# Altium project PERSEUS.PrjPcb
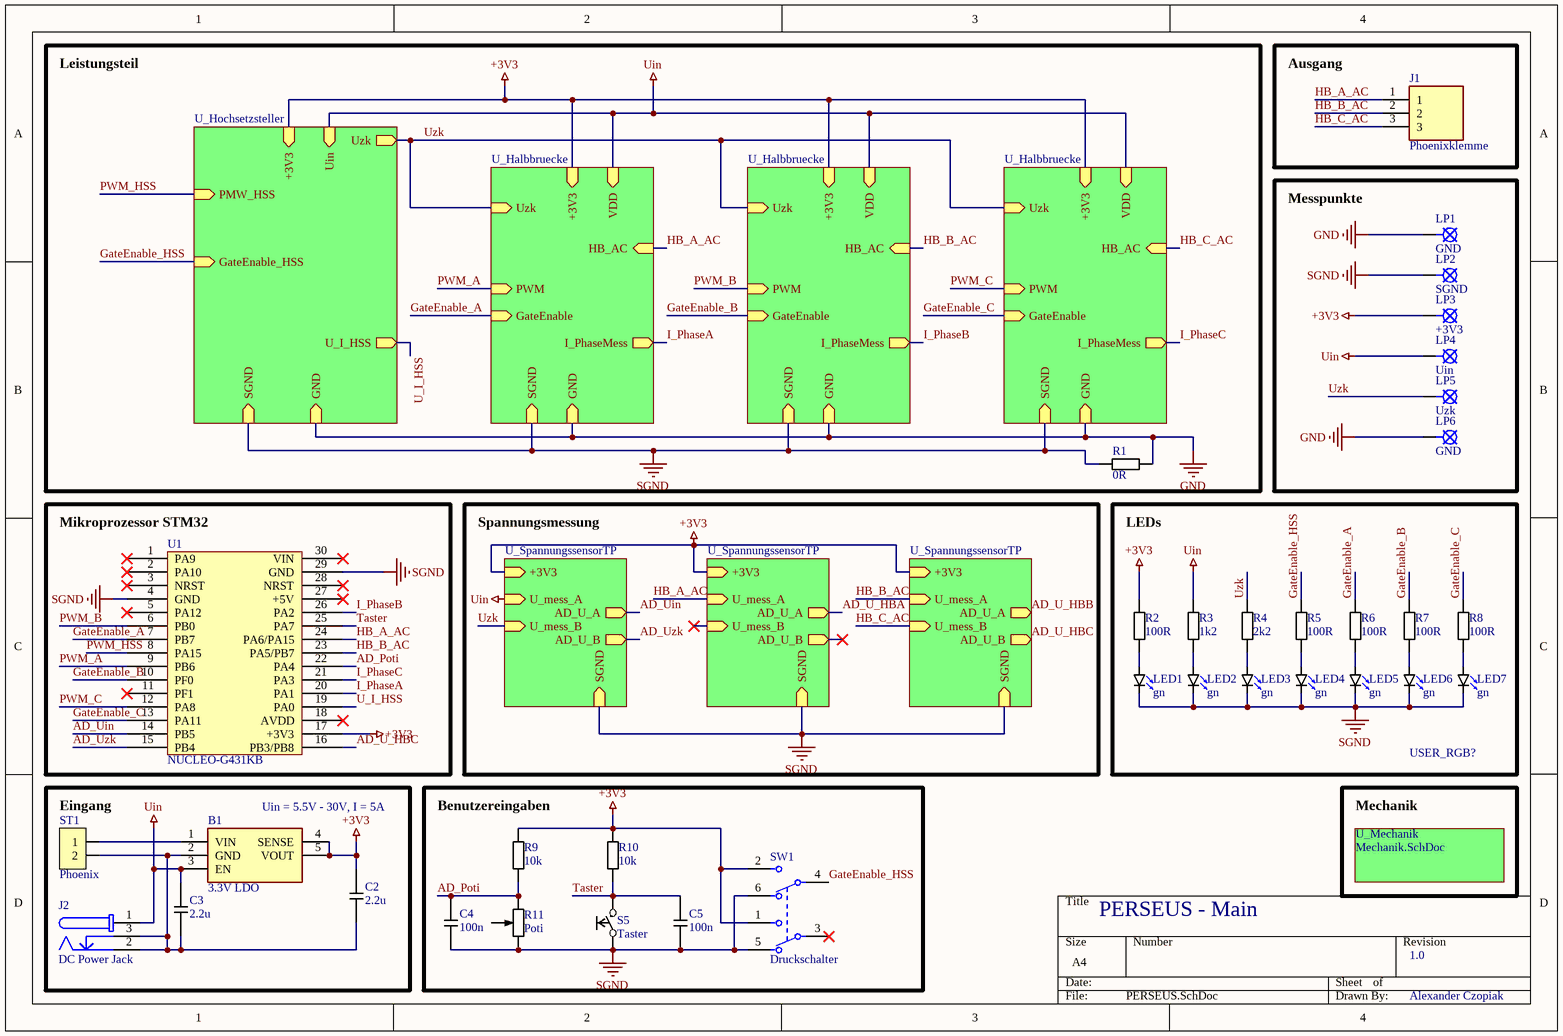
[diagram p0: PERSEUS.SchDoc]
7 sheets, 178 parts. Net scope: hierarchical (ports join the sheet entries above them; power ports are global).
Board file: PERSEUS_PCB.PcbDoc
Sheets:
  PERSEUS.SchDoc
    U_Halbbruecke = Halbbruecke.SchDoc
      U_StromsensorTP = StromsensorTP.SchDoc
      U_Gatetreiber = Gatetreiber.SchDoc
    U_Hochsetzsteller = Hochsetzsteller.SchDoc
      U_StromsensorTP = StromsensorTP.SchDoc
      U_Gatetreiber = Gatetreiber.SchDoc
    U_Halbbruecke = Halbbruecke.SchDoc
      U_StromsensorTP = StromsensorTP.SchDoc
      U_Gatetreiber = Gatetreiber.SchDoc
    U_Halbbruecke = Halbbruecke.SchDoc
      U_StromsensorTP = StromsensorTP.SchDoc
      U_Gatetreiber = Gatetreiber.SchDoc
    U_SpannungssensorTP = SpannungssensorTP.SchDoc
    U_SpannungssensorTP = SpannungssensorTP.SchDoc
    U_Mechanik = Mechanik.SchDoc
    U_SpannungssensorTP = SpannungssensorTP.SchDoc

## Sheet PERSEUS.SchDoc
size A4; SheetNumber: 1; SheetTotal: 7

### Parts
B1  3.3V LDO  [SOT95P280X100-5N]
C2  2.2u  [1206_C]
C3  2.2u  [1206_C]
C4  100n  [1206_C]
C5  100n  [1206_C]
J1  Phoenixklemme  [Phoenix_3er]
J2  DC Power Jack  [694106301002]
LED1  gn  [0805_DI_gr]
LED2  gn  [0805_DI_gr]
LED3  gn  [0805_DI_gr]
LED4  gn  [0805_DI_gr]
LED5  gn  [0805_DI_gr]
LED6  gn  [0805_DI_gr]
LED7  gn  [0805_DI_gr]
LP1  GND  [LP1]
LP2  SGND  [LP1]
LP3  +3V3  [LP1]
LP4  Uin  [LP1]
LP5  Uzk  [LP1]
LP6  GND  [LP1]
R1  0R  [1206_R]
R2  100R  [1206_R]
R3  1k2  [1206_R]
R4  2k2  [1206_R]
R5  100R  [1206_R]
R6  100R  [1206_R]
R7  100R  [1206_R]
R8  100R  [1206_R]
R9  10k  [1206_R]
R10  10k  [1206_R]
R11  Poti  [POT_T607_3D]
S5  Taster  [TASTERSMD_3D]
ST1  Phoenix  [MKDS 1,5/ 2]
SW1  Druckschalter  [FP-ESB-33133-MFG]
U1  NUCLEO-G431KB  [NUCLEO-G431KB]

### Blocks framed on the sheet
Leistungsteil: R1
Ausgang: J1
Messpunkte: LP1-LP6
Mikroprozessor STM32: U1
LEDs: LED1-LED7 R2-R8
Eingang: B1 C2 C3 J2 ST1
Benutzereingaben: C4 C5 R9-R11 S5 SW1

### Sub-sheets
U_Halbbruecke = Halbbruecke.SchDoc: HB_AC (in), GND (in), I_PhaseMess (out), SGND (in), GateEnable (in), +3V3 (in), Uzk (in), VDD (in), PWM (in)
U_Halbbruecke = Halbbruecke.SchDoc: HB_AC (in), GND (in), I_PhaseMess (out), SGND (in), GateEnable (in), +3V3 (in), Uzk (in), VDD (in), PWM (in)
U_Halbbruecke = Halbbruecke.SchDoc: HB_AC (in), I_PhaseMess (out), GateEnable (in), Uzk (in), PWM (in), GND (in), SGND (in), +3V3 (in), VDD (in)
U_Hochsetzsteller = Hochsetzsteller.SchDoc: Uin (in), U_I_HSS (out), Uzk (out), PMW_HSS (in), GateEnable_HSS (in), GND (in), SGND (in), +3V3 (in)
U_Mechanik = Mechanik.SchDoc: no entries
U_SpannungssensorTP = SpannungssensorTP.SchDoc: AD_U_B (out), U_mess_B (in), SGND (in), AD_U_A (out), U_mess_A (in), +3V3 (in)
U_SpannungssensorTP = SpannungssensorTP.SchDoc: AD_U_B (out), U_mess_B (in), SGND (in), AD_U_A (out), U_mess_A (in), +3V3 (in)
U_SpannungssensorTP = SpannungssensorTP.SchDoc: AD_U_B (out), U_mess_B (in), SGND (in), AD_U_A (out), U_mess_A (in), +3V3 (in)

### Nets
+3V3: B1.4(SENSE) B1.5(VOUT) C2.2 LP3.1 R2.2 R9.2 R10.2 SW1.1(1_NO) SW1.2(2_NO) U1.17(+3V3) ; sheet U_Halbbruecke/+3V3, sheet U_Hochsetzsteller/+3V3, sheet U_Halbbruecke/+3V3, sheet U_Halbbruecke/+3V3, sheet U_SpannungssensorTP/+3V3, sheet U_SpannungssensorTP/+3V3, sheet U_SpannungssensorTP/+3V3
GND: LP1.1 LP6.1 R1.1 ; sheet U_Halbbruecke/GND, sheet U_Hochsetzsteller/GND, sheet U_Halbbruecke/GND, sheet U_Halbbruecke/GND
SGND: C4.1 C5.1 LED1.2(K) LED2.2(K) LED3.2(K) LED4.2(K) LED5.2(K) LED6.2(K) LED7.2(K) LP2.1 R1.2 R11.1 S5.2 SW1.5(1_NC) SW1.6(2_NC) U1.4(GND) U1.29(GND) ; sheet U_Halbbruecke/SGND, sheet U_Hochsetzsteller/SGND, sheet U_Halbbruecke/SGND, sheet U_Halbbruecke/SGND, sheet U_SpannungssensorTP/SGND, sheet U_SpannungssensorTP/SGND, sheet U_SpannungssensorTP/SGND
Uin: B1.3(EN) C3.2 J2.1 LP4.1 R3.2 ; sheet U_Halbbruecke/VDD, sheet U_Hochsetzsteller/Uin, sheet U_Halbbruecke/VDD, sheet U_Halbbruecke/VDD, sheet U_SpannungssensorTP/U_mess_A
AD_Poti: C4.2 R9.1 R11.2 U1.22(PA4)
AD_U_HBC: U1.16(PB3/PB8) ; sheet U_SpannungssensorTP/AD_U_B
AD_Uin: U1.14(PB5) ; sheet U_SpannungssensorTP/AD_U_A
AD_Uzk: U1.15(PB4) ; sheet U_SpannungssensorTP/AD_U_B
GateEnable_A: R6.2 U1.7(PB7) ; sheet U_Halbbruecke/GateEnable
GateEnable_B: R7.2 U1.10(PF0) ; sheet U_Halbbruecke/GateEnable
GateEnable_C: R8.2 U1.13(PA11) ; sheet U_Halbbruecke/GateEnable
GateEnable_HSS: R5.2 SW1.4(2_C) ; sheet U_Hochsetzsteller/GateEnable_HSS
HB_A_AC: J1.1 U1.24(PA6/PA15) ; sheet U_Halbbruecke/HB_AC, sheet U_SpannungssensorTP/U_mess_A
HB_B_AC: J1.2 U1.23(PA5/PB7) ; sheet U_Halbbruecke/HB_AC, sheet U_SpannungssensorTP/U_mess_A
HB_C_AC: J1.3 ; sheet U_Halbbruecke/HB_AC, sheet U_SpannungssensorTP/U_mess_B
I_PhaseA: U1.20(PA1) ; sheet U_Halbbruecke/I_PhaseMess
I_PhaseB: U1.26(PA2) ; sheet U_Halbbruecke/I_PhaseMess
I_PhaseC: U1.21(PA3) ; sheet U_Halbbruecke/I_PhaseMess
PWM_A: U1.9(PB6) ; sheet U_Halbbruecke/PWM
PWM_B: U1.6(PB0) ; sheet U_Halbbruecke/PWM
PWM_C: U1.12(PA8) ; sheet U_Halbbruecke/PWM
PWM_HSS: U1.8(PA15) ; sheet U_Hochsetzsteller/PMW_HSS
Taster: C5.2 R10.1 S5.1 U1.25(PA7)
U_I_HSS: U1.19(PA0) ; sheet U_Hochsetzsteller/U_I_HSS
Uzk: LP5.1 R4.2 ; sheet U_Halbbruecke/Uzk, sheet U_Hochsetzsteller/Uzk, sheet U_Halbbruecke/Uzk, sheet U_Halbbruecke/Uzk, sheet U_SpannungssensorTP/U_mess_B
NetB1_1: B1.1(VIN) ST1.1
NetB1_2: B1.2(GND) C2.1 C3.1 J2.2 J2.3 ST1.2
NetLED1_1: LED1.1(A) R2.1
NetLED2_1: LED2.1(A) R3.1
NetLED3_1: LED3.1(A) R4.1
NetLED4_1: LED4.1(A) R5.1
NetLED5_1: LED5.1(A) R6.1
NetLED6_1: LED6.1(A) R7.1
NetLED7_1: LED7.1(A) R8.1

Not connected (* = marked no-connect by the designer): R11 W(Abgriff); SW1 3(1_C)*; U1 1(PA9)* 2(PA10)* 3(NRST)* 5(PA12)* 11(PF1)* 18(AVDD)* 27(+5V)* 28(NRST)* 30(VIN)*

### Notes on the sheet
- Spannungsmessung
- USER_RGB?
- (near B1) Uin = 5.5V - 30V, I = 5A
- Mechanik
- PERSEUS - Main
- 1.0
- Alexander Czopiak

### Library data of the parts
B1 = Spannungsregler: 40V, 200mA, Low Noise, CMOS LDO Linear Regulator, ADPL44002AUJZ-3.3-R7; Manufacturer_Name: Analog Devices; Geometry.Height: 1mm; Mouser Part Number: 584-PL44002AUJZ33R7; Mouser Price/Stock: https://www.mouser.co.uk/ProductDetail/Analog-Devices/ADPL44002AUJZ-3.3-R7?qs=%252BXxaIXUDbq3bLG2Aqffs8Q%3D%3D; Manufacturer_Part_Number: ADPL44002AUJZ-3.3-R7; Datasheet Link: https://www.analog.com/ADPL44002/datasheet
C2 C3 = CAP: Min 2.2uF
C4 C5 = CAP: Kondensator (ohne Polarität)
J1 = Leiterbahnklemme: Phoenix: Fixed Terminal Blocks 3P 7.5mm GMKDS 1,5/ 3; Manufacturer_Name: Phoenix Contact; Manufacturer_Part_Number: 1717033; Geometry.Height: 13.9mm; Mouser Part Number: 651-1717033; Mouser Price/Stock: https://www.mouser.co.uk/ProductDetail/Phoenix-Contact/1717033?qs=aYsvlkyO7qPHPfcN%252B81Plg%3D%3D; Arrow Part Number: 1717033; Arrow Price/Stock: https://www.arrow.com/en/products/1717033/phoenix-contact?utm_currency=USD&region=nac; Datasheet Link: https://media.digikey.com/pdf/Data%20Sheets/Phoenix%20Contact%20PDFs/1717033.pdf
J2 = CMP-1502-00188-2: NexarPartId: 52676100; Voltage Rating (DC): 20V; Gender: Male; Voltage Rating: 24V; Insulation Resistance: 100MΩ; Current Rating: 5A; Shielding: Unshielded; Number of Contacts: 3; Color: Black; Housing Material: Polyamide; Contact Gender: Female; Connector Type: Power; REACH SVHC: Unknown; Termination: Through Hole; Height: 11mm; RoHS: Compliant; Mount: Through Hole; Flammability Rating: UL94 V-0; Packaging: Bulk; Min Operating Temperature: -40°C; Contact Plating: Tin; Max Operating Temperature: 85°C; Operating Supply Voltage: 24V; Contact Material: Gold, Tin
LED1-LED7 = LED SMD 0805: LED SMD 0805 (gruen)
LP1-LP6 = LP
R1 R2 R7 R8 = WIDERSTAND: LED Vorwiderstand: Min 65 Ohm, Berechnet für 3.3V, 2V Spannungsabfall, 20mA Strom
R3 R9 R10 = WIDERSTAND: LED Vorwiderstand: Min 1.4 kOhm Berechnet für 30V Uin und 2 V Spannungsabfall und If=20mA
R4-R6 = WIDERSTAND
R11 = POT: Widerstand
S5 = TASTER-SMD
ST1 = CONN02: Phönix-Klemme
SW1 = CMP-05613-000004-1: SWITCH PUSH DPDT 0.2A 14V; Switch Function: On-On; Contact Current Rating: 200mA; Actuator Type: Lever; Mount: Through Hole; Voltage Rating (DC): 14V; Package Quantity: 100; Orientation: Vertical; RoHS Compliant: Yes; Contact Plating: Silver; Packaging: Bulk; Radiation Hardening: No; Throw Configuration: DPDT; Termination: PC Pin; REACH SVHC: No SVHC; Max Operating Temperature: 80°C; Min Operating Temperature: -30°C; Lead Free: Lead Free; Current Rating: 200mA; Series: ESB33; Width: 10mm; Length: 10mm

## Sheet Halbbruecke.SchDoc
size A4; SheetNumber: 2; SheetTotal: 6
Used 3 times, as channels U_Halbbruecke, U_Halbbruecke, U_Halbbruecke. Parts and nets are listed once, with the designators drawn on the sheet.
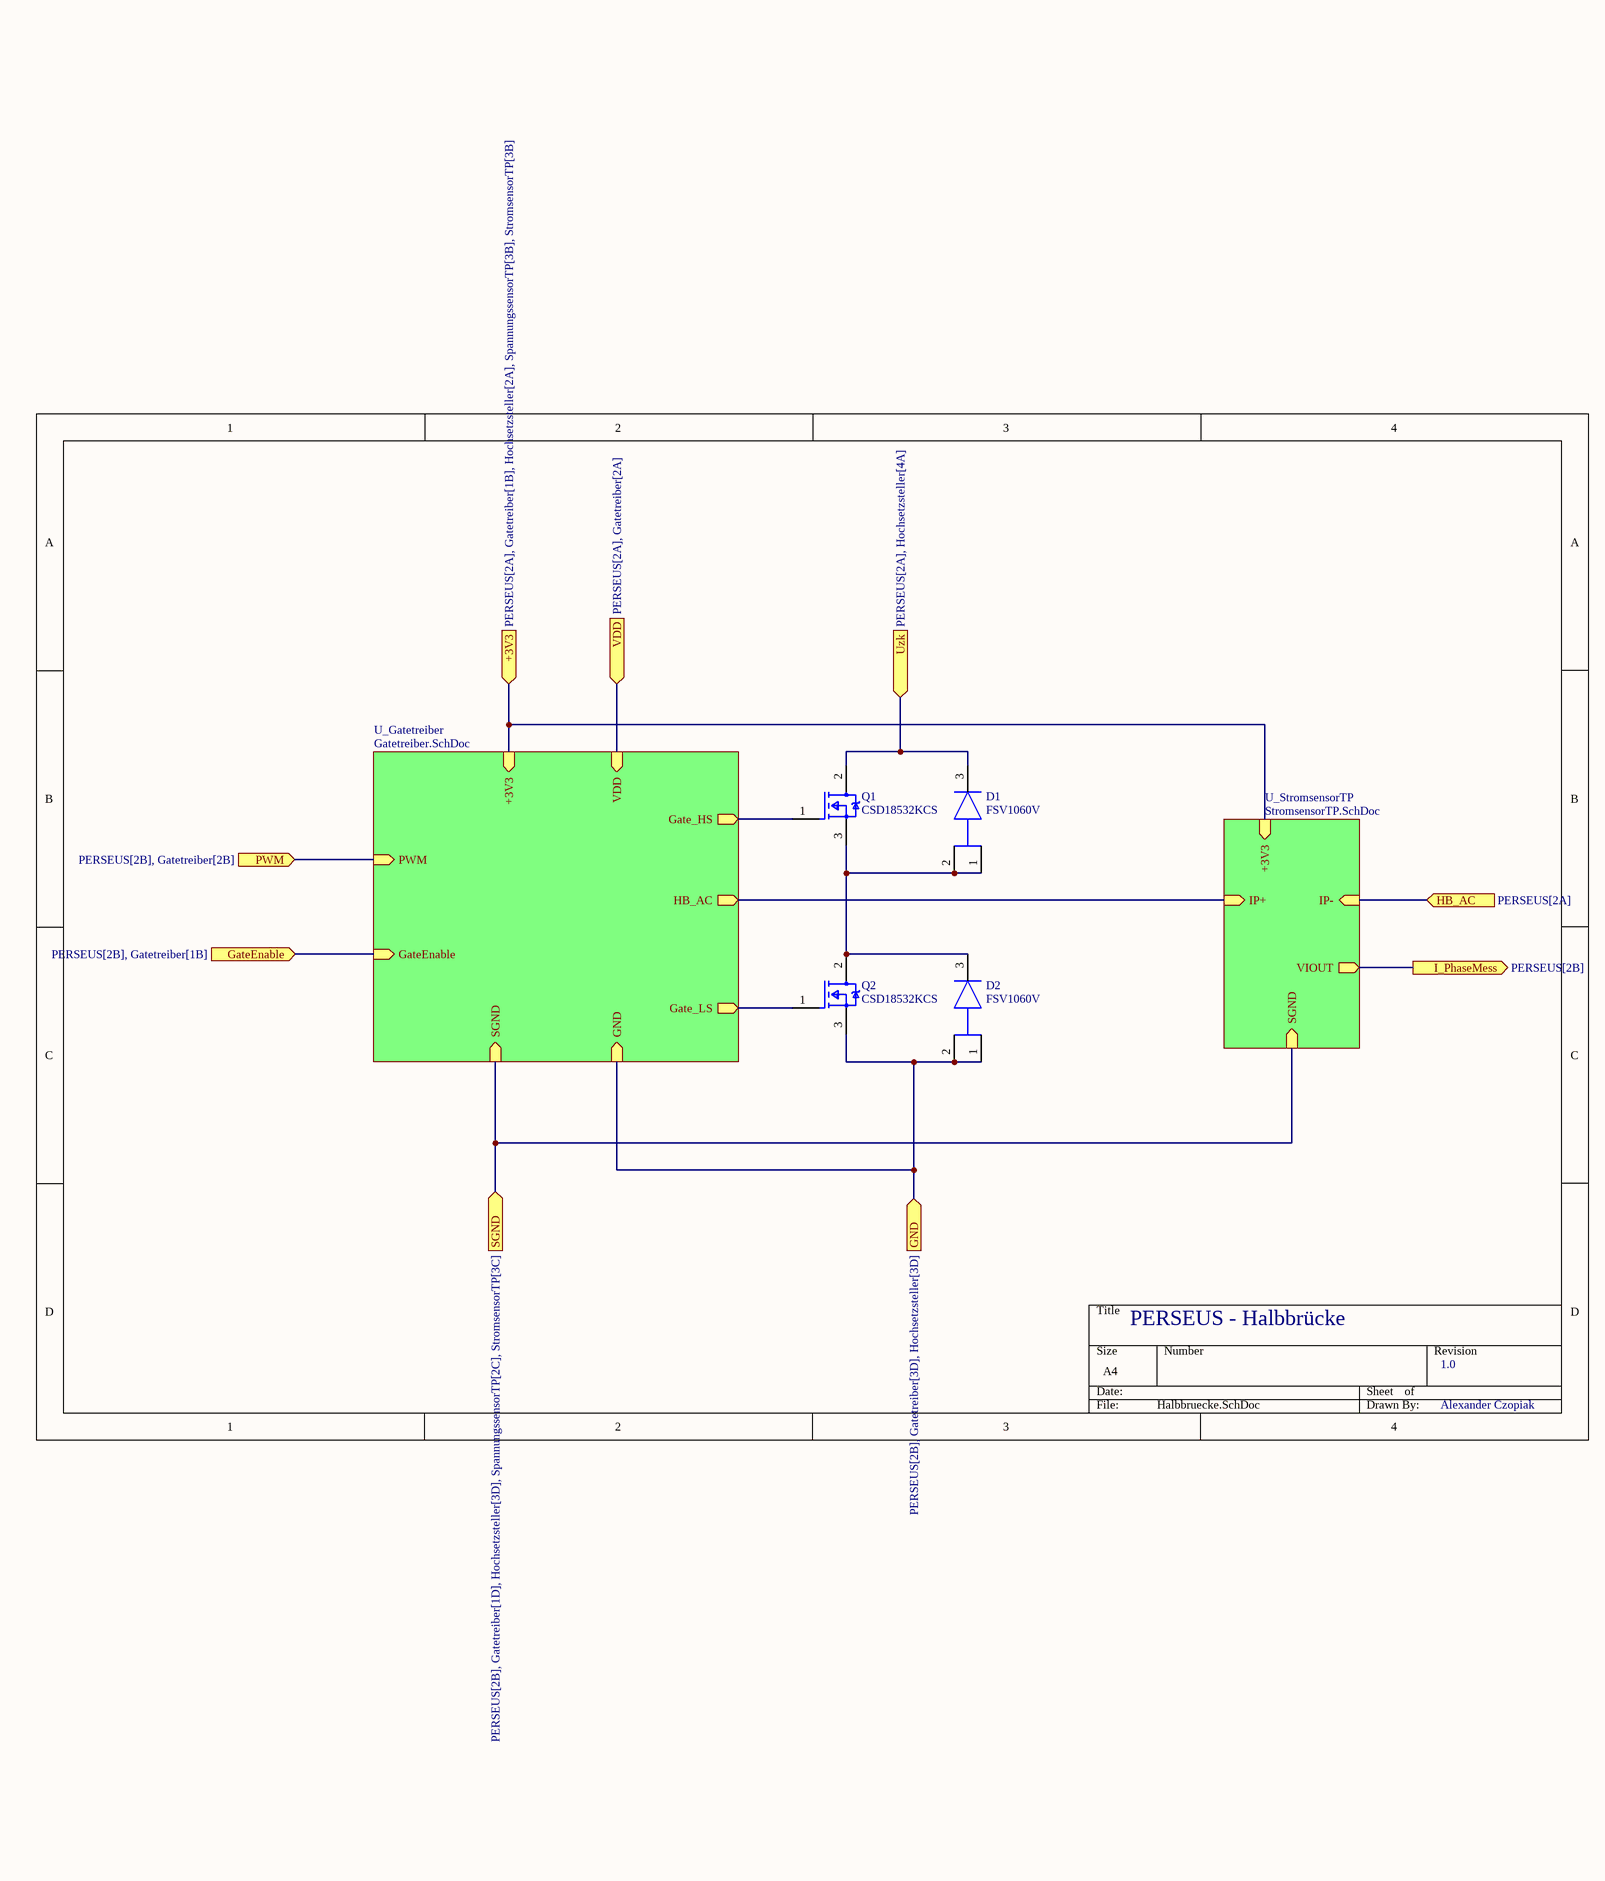
[diagram p1: Halbbruecke.SchDoc]

### Parts
D1  FSV1060V  [FP-340BQ-MFG]
D2  FSV1060V  [FP-340BQ-MFG]
Q1  CSD18532KCS  [FP-PG-TO220-3-MFG]
Q2  CSD18532KCS  [FP-PG-TO220-3-MFG]

### Sub-sheets
U_Gatetreiber = Gatetreiber.SchDoc: PWM (in), GateEnable (in), Gate_HS (out), HB_AC (out), Gate_LS (out), VDD (in), +3V3 (in), GND (in), SGND (in)
U_StromsensorTP = StromsensorTP.SchDoc: IP+ (in), VIOUT (out), SGND (in), +3V3 (in), IP- (in)

### Ports
+3V3 (in, see PERSEUS[2A], Gatetreiber[1B], Hochsetzsteller[2A], SpannungssensorTP[3B], StromsensorTP[3B]), GateEnable (in, see PERSEUS[2B], Gatetreiber[1B]), GND (in, see PERSEUS[2B], Gatetreiber[3D], Hochsetzsteller[3D]), HB_AC (in, see PERSEUS[2A]), I_PhaseMess (out, see PERSEUS[2B]), PWM (in, see PERSEUS[2B], Gatetreiber[2B]), SGND (in, see PERSEUS[2B], Gatetreiber[1D], Hochsetzsteller[3D], SpannungssensorTP[2C], StromsensorTP[3C]), Uzk (in, see PERSEUS[2A], Hochsetzsteller[4A]), VDD (in, see PERSEUS[2A], Gatetreiber[2A])

### Nets
+3V3: port +3V3, sheet U_StromsensorTP/+3V3, sheet U_Gatetreiber/+3V3
GateEnable: port GateEnable, sheet U_Gatetreiber/GateEnable
GND: D2.1(Anode_1) D2.2(Anode_2) Q2.3(SOURCE) ; port GND, sheet U_Gatetreiber/GND
HB_AC: port HB_AC, sheet U_StromsensorTP/IP-
I_PhaseMess: port I_PhaseMess, sheet U_StromsensorTP/VIOUT
PWM: port PWM, sheet U_Gatetreiber/PWM
SGND: port SGND, sheet U_StromsensorTP/SGND, sheet U_Gatetreiber/SGND
Uzk: D1.3(C) Q1.2(DRAIN) ; port Uzk
VDD: port VDD, sheet U_Gatetreiber/VDD
NetD1_1: D1.1(Anode_1) D1.2(Anode_2) D2.3(C) Q1.3(SOURCE) Q2.2(DRAIN)
NetQ1_1: Q1.1(GATE) ; sheet U_Gatetreiber/Gate_HS
NetQ2_1: Q2.1(GATE) ; sheet U_Gatetreiber/Gate_LS
(unnamed): sheet U_StromsensorTP/IP+, sheet U_Gatetreiber/HB_AC

### Channels
U_Halbbruecke: designators end in C; ports +3V3=+3V3 GateEnable=GateEnable_A GND=GND HB_AC=HB_A_AC I_PhaseMess=I_PhaseA PWM=PWM_A SGND=SGND Uzk=Uzk VDD=Uin
U_Halbbruecke: designators end in B; ports +3V3=+3V3 GateEnable=GateEnable_B GND=GND HB_AC=HB_B_AC I_PhaseMess=I_PhaseB PWM=PWM_B SGND=SGND Uzk=Uzk VDD=Uin
U_Halbbruecke: designators end in A; ports +3V3=+3V3 GateEnable=GateEnable_C GND=GND HB_AC=HB_C_AC I_PhaseMess=I_PhaseC PWM=PWM_C SGND=SGND Uzk=Uzk VDD=Uin

### Notes on the sheet
- PERSEUS - Halbbrücke
- 1.0
- Alexander Czopiak

### Library data of the parts
D1 D2 = CMP-07162-000018-1: DIODE SCHOTTKY 60V 10A TO277-3; Manufacturer: ON Semiconductor; Max Junction Temp: +150°C; Max Surge Forward Current: 280A; Peak Reverse Current: 0.056mA; Capacitance: 550pF; Value: 550pF; Device Class L2: Diodes; RoHS: TRUE; Lead Free: Yes; Temperature Range High: +150°C; ComponentLink2URL: https://www.onsemi.com/pub/Collateral/FSV1060V-D.pdf; Temperature Range Low: -55°C; Max Repetitive Reverse Voltage: 60V; Footprint Url: https://www.onsemi.com/pub/Collateral/340BQ.PDF; Reverse Voltage: 60V; Device Class L1: Discrete Semiconductors; Octopart: https://octopart.com/fsv1060v-on+semiconductor-84328651; Height: 1.2mm; Digikey Description: DIODE SCHOTTKY 60V 10A TO277-3; ComponentLink2Description: Datasheet; Manufacturer Part Number: FSV1060V; Temperature: -55°C to +150°C; Package: 340BQ; Device Class L3: Schottky Diodes; Forward Current: 10A; Automotive: No; Mouser Description: Schottky Diodes & Rectifiers Schottky; Category: Diode
Q1 Q2 = CMP-32901-001154-1: MOSFET N-CH 60V 100A TO220; Polarization: N; Power Dissipation: 115W; Rds On Max: 16.5mR; Gate to Source Voltage (Vgs): 20V; Continuous Drain Current (ID): 55A; Threshold Voltage: 4V; Turn-On Delay Time: 13ns; Element Configuration: Single; Input Capacitance: 1.812nF; Turn-Off Delay Time: 40ns; Mount: Through Hole; Drain to Source Voltage (Vdss): 60V; Max Dual Supply Voltage: 60V; Length: 0.42inch; Height: 0.65inch; Width: 0.19inch; Packaging: Rail/Tube; Halogen Free: Halogen Free; Number of Pins: 3; Drain to Source Resistance: 16.5mR; Series: HEXFET®; RoHS Compliant: Yes; Reach SVHC Compliant: Yes; Drain to Source Breakdown Voltage: 60V; Max Operating Temperature: 175°C; Case/Package: TO-220; Max Power Dissipation: 115W; Lead Free: Lead Free; Min Operating Temperature: -55°C

## Sheet StromsensorTP.SchDoc
size A4; SheetNumber: 3; SheetTotal: 7
Used 4 times, as channels U_Halbbruecke/U_StromsensorTP, U_Hochsetzsteller/U_StromsensorTP, U_Halbbruecke/U_StromsensorTP, U_Halbbruecke/U_StromsensorTP. Parts and nets are listed once, with the designators drawn on the sheet.
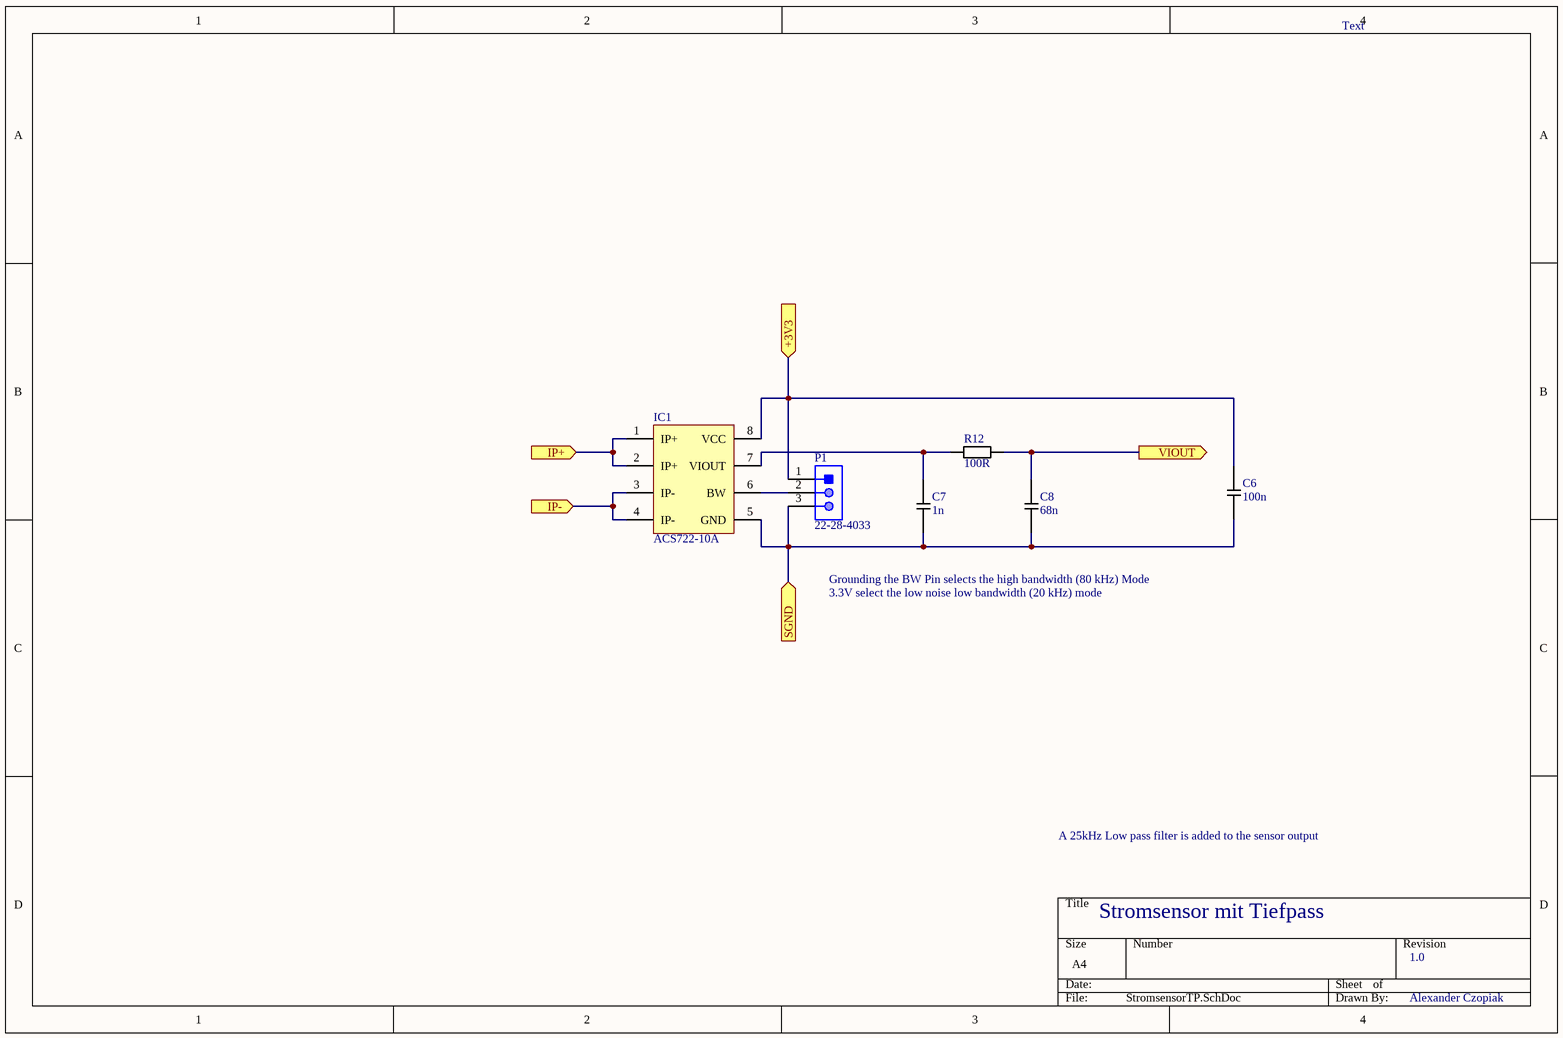
[diagram p2: StromsensorTP.SchDoc]

### Parts
C6  100n  [1206_C]
C7  1n  [1206_C]
C8  68n  [1206_C]
IC1  ACS722-10A  [SO08_N]
P1  22-28-4033  [MOLX-22-28-4033_V]
R12  100R  [1206_R]

### Ports
+3V3 (in, see Halbbruecke[4B], Gatetreiber[1B], Halbbruecke[2B], Hochsetzsteller[2A], SpannungssensorTP[4B]), IP+ (in, see Halbbruecke[4B]), IP- (in, see Halbbruecke[4B]), SGND (in, see Halbbruecke[4C], Gatetreiber[1D], Halbbruecke[2D], Hochsetzsteller[3D], SpannungssensorTP[3C]), VIOUT (out, see Halbbruecke[4C])

### Nets
+3V3: C6.2 IC1.8(VCC) P1.1 ; port +3V3
IP+: IC1.1(IP+) IC1.2(IP+) ; port IP+
IP-: IC1.3(IP-) IC1.4(IP-) ; port IP-
SGND: C6.1 C7.1 C8.1 IC1.5(GND) P1.3 ; port SGND
VIOUT: C8.2 R12.2 ; port VIOUT
NetC7_2: C7.2 IC1.7(VIOUT) R12.1
NetIC1_6: IC1.6(BW) P1.2

### Channels
U_Halbbruecke/U_StromsensorTP: designators end in C; ports +3V3=+3V3 IP+=NetC15C_1 IP-=HB_A_AC SGND=SGND VIOUT=I_PhaseA
U_Hochsetzsteller/U_StromsensorTP: designators end in D; ports +3V3=+3V3 IP+=NetD4_1 IP-=GND SGND=SGND VIOUT=U_I_HSS
U_Halbbruecke/U_StromsensorTP: designators end in B; ports +3V3=+3V3 IP+=NetC15B_1 IP-=HB_B_AC SGND=SGND VIOUT=I_PhaseB
U_Halbbruecke/U_StromsensorTP: designators end in A; ports +3V3=+3V3 IP+=NetC15A_1 IP-=HB_C_AC SGND=SGND VIOUT=I_PhaseC

### Notes on the sheet
- Text
- Grounding the BW Pin selects the high bandwidth (80 kHz) Mode
- 3.3V select the low noise low bandwidth (20 kHz) mode
- A 25kHz Low pass filter is added to the sensor output
- Stromsensor mit Tiefpass
- 1.0
- Alexander Czopiak

### Library data of the parts
C6-C8 = CAP: Kondensator (ohne Polarität)
IC1 = Current Sensor ACS722: ComponentLink1Description: Datasheet; ComponentLink1URL: https://ebs.eti.kit.edu/files/ebs_uploads/20170616-1458_Datenblatt_ACS722LLCTR-10AB-T.pdf
P1 = CMP-1676-00001-5: Stiftleiste 3 fach, Male Header, Pitch 2.54 mm, 1 x 3 Position, Height 8.38 mm, Tail Length 3.18 mm, RoHS, Bulk; Manufacturer: Molex; Rows: 1; Voltage Rating: 250 V; Current Rating: 4 A; Min Operating Temperature: 0 degC; Lead Pitch: 0.1 inch; Packaging: Bulk; Contact Finish: Gold; RoHSCompliant: true; Contact Material: Brass; PackageReference: 22-28-4033; REACH SVHC: Unknown; PackageDescription: Male Header, Pitch 2.54 mm, 1 x 3 Position, Height 8.38 mm, Tail Length 3.18 mm; ComponentLink2URL: http://www.molex.com/pdm_docs/sd/022284033_sd.pdf; Height: 8.38 mm; Mounting Technology: Through Hole; ComponentLink1Description: Manufacturer URL; Length: 7.62 mm; Mount: Through Hole; DatasheetVersion: Rev. G, 01/2012; Max Operating Temperature: 75 degC; ComponentLink2Description: Datasheet; Colour: Black; Pins: 3; Contact Plating: Gold; Package Quantity: 1; ComponentLink1URL: http://www.molex.com/
R12 = WIDERSTAND

## Sheet Gatetreiber.SchDoc
size A4; SheetNumber: 4; SheetTotal: 7
Used 4 times, as channels U_Halbbruecke/U_Gatetreiber, U_Hochsetzsteller/U_Gatetreiber, U_Halbbruecke/U_Gatetreiber, U_Halbbruecke/U_Gatetreiber. Parts and nets are listed once, with the designators drawn on the sheet.
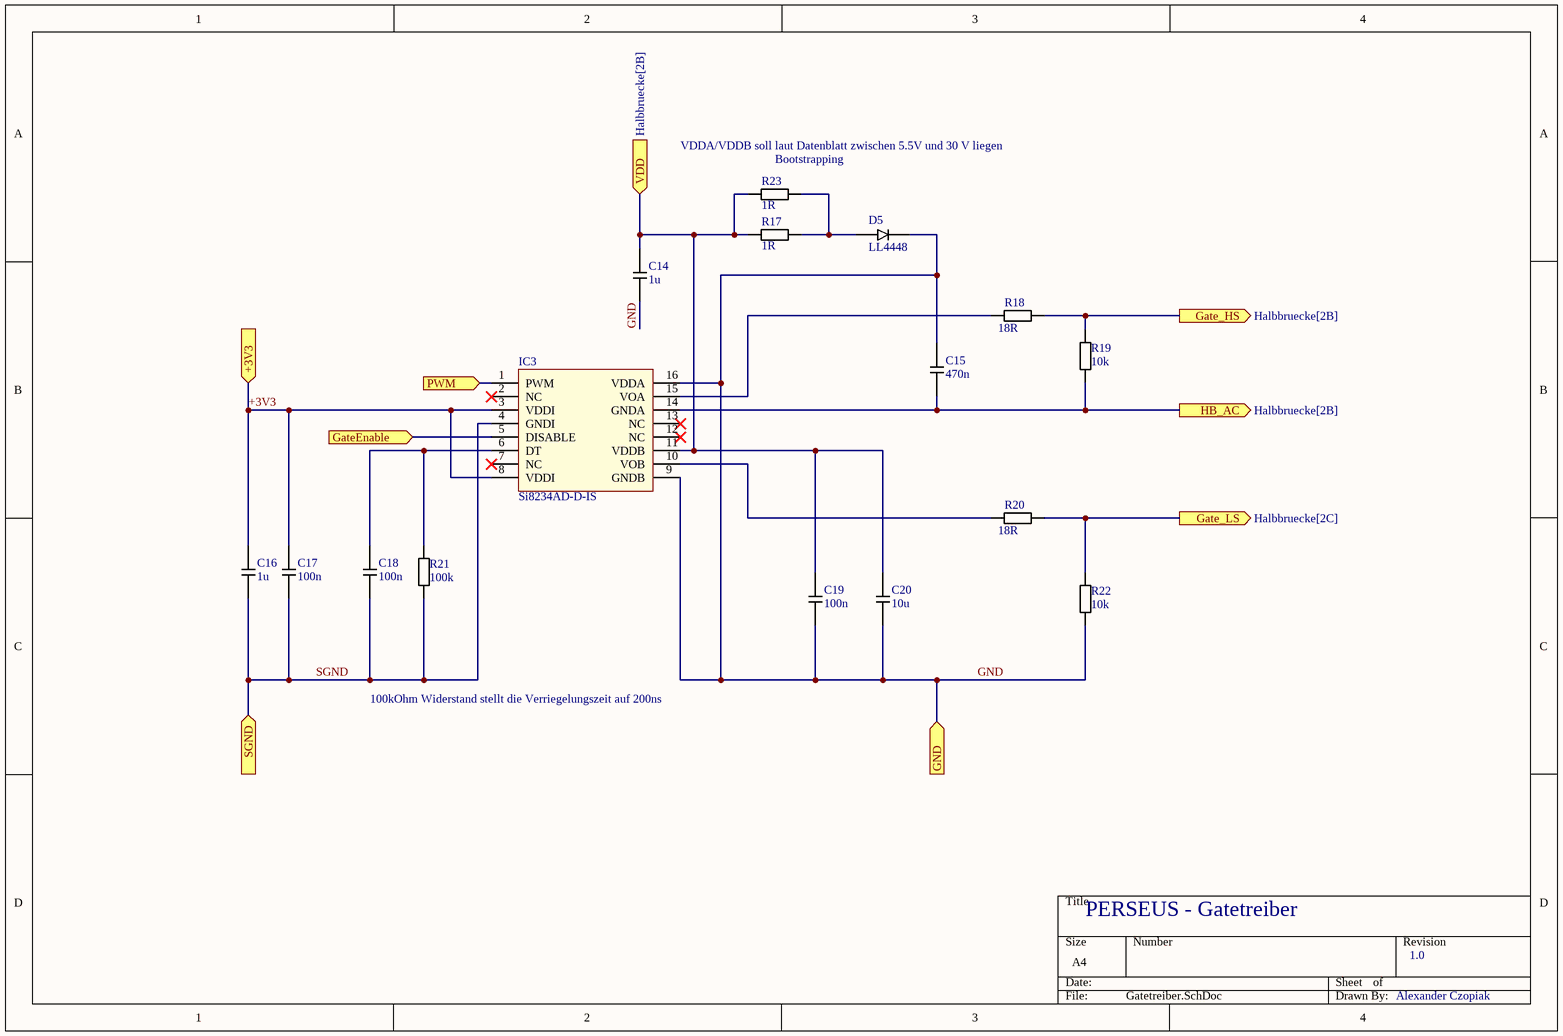
[diagram p3: Gatetreiber.SchDoc]

### Parts
C14  1u  [1206_C]
C15  470n  [1206_C]
C16  1u  [1206_C]
C17  100n  [1206_C]
C18  100n  [1206_C]
C19  100n  [1206_C]
C20  10u  [1206_C]
D5  LL4448  [MINIMELF-SOD80]
IC3  Si8234AD-D-IS  [SO16_W]
R17  1R  [1206_R]
R18  18R  [1206_R]
R19  10k  [1206_R]
R20  18R  [1206_R]
R21  100k  [1206_R]
R22  10k  [1206_R]
R23  1R  [1206_R]

### Ports
+3V3 (in, see Halbbruecke[2B], Hochsetzsteller[2A], SpannungssensorTP[4B], StromsensorTP[3B]), Gate_HS (out, see Halbbruecke[2B]), Gate_LS (out, see Halbbruecke[2C]), GateEnable (in, see Halbbruecke[1C]), GND (in, see Halbbruecke[2C], Halbbruecke[3D], Hochsetzsteller[3D]), HB_AC (out, see Halbbruecke[2B]), PWM (in, see Halbbruecke[1B]), SGND (in, see Halbbruecke[2C], Halbbruecke[2D], Hochsetzsteller[3D], SpannungssensorTP[3C], StromsensorTP[3C]), VDD (in, see Halbbruecke[2B])

### Nets
+3V3: C16.2 C17.2 IC3.3(VDDI) IC3.8(VDDI) ; port +3V3
Gate_HS: R18.2 R19.1 ; port Gate_HS
Gate_LS: R20.2 R22.2 ; port Gate_LS
GateEnable: IC3.5(DISABLE) ; port GateEnable
GND: C14.1 C15.2 C19.1 C20.1 D5.2(K) IC3.9(GNDB) IC3.16(VDDA) R22.1 ; port GND
HB_AC: C15.1 IC3.14(GNDA) R19.2 ; port HB_AC
PWM: IC3.1(PWM) ; port PWM
SGND: C16.1 C17.1 C18.1 IC3.4(GNDI) R21.1 ; port SGND
VDD: C14.2 C19.2 C20.2 IC3.11(VDDB) R17.1 R23.1 ; port VDD
NetC18_2: C18.2 IC3.6(DT) R21.2
NetD5_1: D5.1(A) R17.2 R23.2
NetIC3_10: IC3.10(VOB) R20.1
NetIC3_15: IC3.15(VOA) R18.1

Not connected (* = marked no-connect by the designer): IC3 2(NC)* 7(NC)* 12(NC)* 13(NC)*

### Channels
U_Halbbruecke/U_Gatetreiber: designators end in C; ports +3V3=+3V3 Gate_HS=NetQ1C_1 Gate_LS=NetQ2C_1 GateEnable=GateEnable_A GND=GND HB_AC=NetC15C_1 PWM=PWM_A SGND=SGND VDD=Uin
U_Hochsetzsteller/U_Gatetreiber: designators end in D; ports +3V3=+3V3 Gate_HS=NetQ3_1 Gate_LS=NetQ4_1 GateEnable=GateEnable_HSS GND=GND HB_AC=NetC15D_1 PWM=PWM_HSS SGND=SGND VDD=Uin
U_Halbbruecke/U_Gatetreiber: designators end in B; ports +3V3=+3V3 Gate_HS=NetQ1B_1 Gate_LS=NetQ2B_1 GateEnable=GateEnable_B GND=GND HB_AC=NetC15B_1 PWM=PWM_B SGND=SGND VDD=Uin
U_Halbbruecke/U_Gatetreiber: designators end in A; ports +3V3=+3V3 Gate_HS=NetQ1A_1 Gate_LS=NetQ2A_1 GateEnable=GateEnable_C GND=GND HB_AC=NetC15A_1 PWM=PWM_C SGND=SGND VDD=Uin

### Notes on the sheet
- (near R23) VDDA/VDDB soll laut Datenblatt zwischen 5.5V und 30 V liegen
- (near R23) Bootstrapping
- 100kOhm Widerstand stellt die Verriegelungszeit auf 200ns
- PERSEUS - Gatetreiber
- 1.0
- Alexander Czopiak

### Library data of the parts
C14-C20 = CAP: Kondensator (ohne Polarität)
D5 = DIODE: Diode (z.B. 1N4448)
IC3 = Si8234AD-D-IS: Gate-Treiber 5 kV 5 V UVLO HS/LS isolated gate driver with PWM input, deadtime with external resistor; EBS_Nummer: 8717; HelpURL: https://ebs.eti.kit.edu/Artikel/Detailansicht/8717
R17-R23 = WIDERSTAND

## Sheet Hochsetzsteller.SchDoc
size A4; SheetNumber: 6; SheetTotal: 7
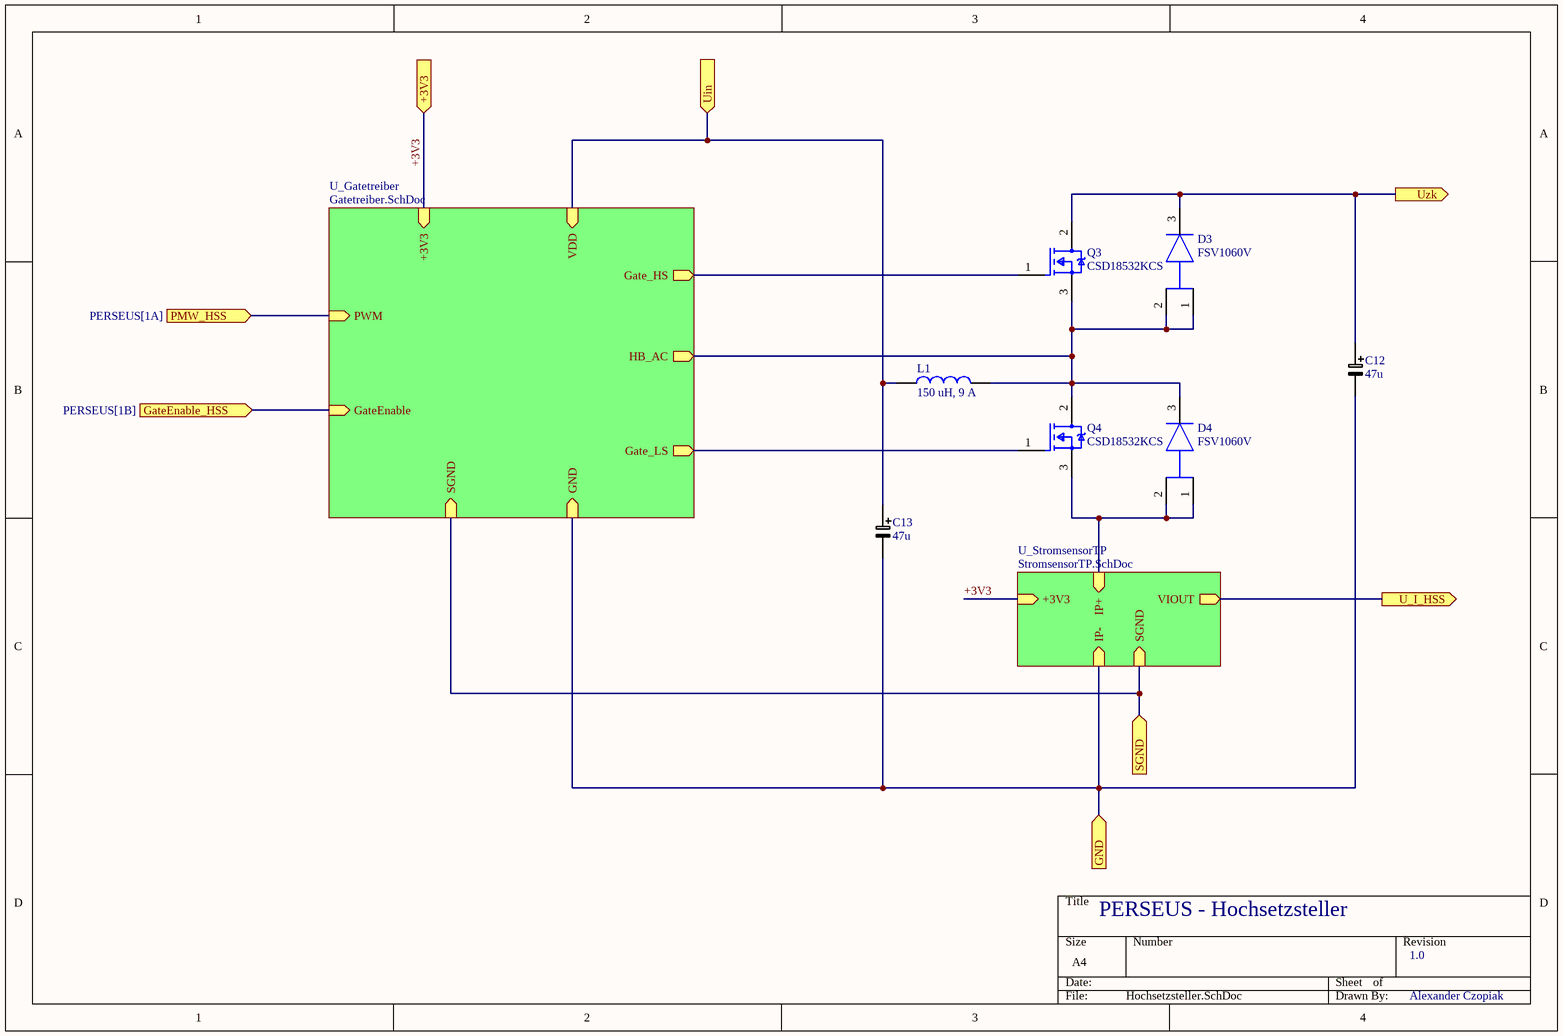
[diagram p4: Hochsetzsteller.SchDoc]

### Parts
C12  47u  [ELKO_5MM_D12.5MM]
C13  47u  [ELKO_5MM_D12.5MM]
D3  FSV1060V  [FP-340BQ-MFG]
D4  FSV1060V  [FP-340BQ-MFG]
L1  150 uH, 9 A  [WE-HCF_2920_Litz]
Q3  CSD18532KCS  [FP-PG-TO220-3-MFG]
Q4  CSD18532KCS  [FP-PG-TO220-3-MFG]

### Sub-sheets
U_Gatetreiber = Gatetreiber.SchDoc: PWM (in), GateEnable (in), Gate_HS (out), HB_AC (out), Gate_LS (out), VDD (in), +3V3 (in), GND (in), SGND (in)
U_StromsensorTP = StromsensorTP.SchDoc: IP+ (in), IP- (in), VIOUT (out), SGND (in), +3V3 (in)

### Ports
+3V3 (in, see PERSEUS[1A], Gatetreiber[1B], Halbbruecke[2B], SpannungssensorTP[4B], StromsensorTP[3B]), GateEnable_HSS (in, see PERSEUS[1B]), GND (in, see PERSEUS[1B], Gatetreiber[3D], Halbbruecke[3D]), PMW_HSS (in, see PERSEUS[1A]), SGND (in, see PERSEUS[1B], Gatetreiber[1D], Halbbruecke[2D], SpannungssensorTP[3C], StromsensorTP[3C]), U_I_HSS (out, see PERSEUS[1B]), Uin (in, see PERSEUS[1A]), Uzk (out, see PERSEUS[1A], Halbbruecke[3B])

### Nets
+3V3: port +3V3, sheet U_StromsensorTP/+3V3, sheet U_Gatetreiber/+3V3
GND: C12.2 C13.2 ; port GND, sheet U_StromsensorTP/IP-, sheet U_Gatetreiber/GND
SGND: port SGND, sheet U_StromsensorTP/SGND, sheet U_Gatetreiber/SGND
Uin: C13.1 L1.1 ; port Uin, sheet U_Gatetreiber/VDD
GateEnable_HSS: port GateEnable_HSS, sheet U_Gatetreiber/GateEnable
PWM_HSS: port PMW_HSS, sheet U_Gatetreiber/PWM
U_I_HSS: port U_I_HSS, sheet U_StromsensorTP/VIOUT
Uzk: C12.1 D3.3(C) Q3.2(DRAIN) ; port Uzk
NetC15D_1: D3.1(Anode_1) D3.2(Anode_2) D4.3(C) L1.2 Q3.3(SOURCE) Q4.2(DRAIN) ; sheet U_Gatetreiber/HB_AC
NetD4_1: D4.1(Anode_1) D4.2(Anode_2) Q4.3(SOURCE) ; sheet U_StromsensorTP/IP+
NetQ3_1: Q3.1(GATE) ; sheet U_Gatetreiber/Gate_HS
NetQ4_1: Q4.1(GATE) ; sheet U_Gatetreiber/Gate_LS

### Notes on the sheet
- PERSEUS - Hochsetzsteller
- 1.0
- Alexander Czopiak

### Library data of the parts
C12 C13 = ELKO_THT: Kondensator Elektrolyt
D3 D4 = CMP-07162-000018-1: as D1 on sheet Halbbruecke; Device Class L2: Diodes; RoHS: TRUE; Lead Free: Yes; Temperature Range High: +150°C; ComponentLink2URL: https://www.onsemi.com/pub/Collateral/FSV1060V-D.pdf; Temperature Range Low: -55°C; Max Repetitive Reverse Voltage: 60V; Footprint Url: https://www.onsemi.com/pub/Collateral/340BQ.PDF; Reverse Voltage: 60V; Device Class L1: Discrete Semiconductors; Octopart: https://octopart.com/fsv1060v-on+semiconductor-84328651; Height: 1.2mm; Digikey Description: DIODE SCHOTTKY 60V 10A TO277-3; ComponentLink2Description: Datasheet; Manufacturer Part Number: FSV1060V; Temperature: -55°C to +150°C; Package: 340BQ; Device Class L3: Schottky Diodes; Forward Current: 10A; Automotive: No; Mouser Description: Schottky Diodes & Rectifiers Schottky; Category: Diode
L1 = Induktivitaet SMD: SMT High Current Inductor WE-HCF, size 2920, 150 uH, 8.4 A; Part Number: 74437429203151; Rated Current: 8.4 A; Inductance: 150 uH; DC Resistance max.: 42.74 mOhm; Self Resonant Frequency: 3.8 MHz; Saturation Current: 7.8 A; ComponentLink1Description: Manufacturer; ComponentLink1URL: http://www.we-online.de; ComponentLink2Description: Datasheet; ComponentLink2URL: https://katalog.we-online.de/pbs/datasheet/74437429203151.pdf; Published Date: November 2018; Publisher: Wurth Elektronik; Size: 2920; Operating Temperature: -40 to 125 degC; Mounting Technology: SMT; Packaging: Tape and Reel
Q3 Q4 = CMP-32901-001154-1: as Q1 on sheet Halbbruecke; Mount: Through Hole; Drain to Source Voltage (Vdss): 60V; Max Dual Supply Voltage: 60V; Length: 0.42inch; Height: 0.65inch; Width: 0.19inch; Packaging: Rail/Tube; Halogen Free: Halogen Free; Number of Pins: 3; Drain to Source Resistance: 16.5mR; Series: HEXFET®; RoHS Compliant: Yes; Reach SVHC Compliant: Yes; Drain to Source Breakdown Voltage: 60V; Max Operating Temperature: 175°C; Case/Package: TO-220; Max Power Dissipation: 115W; Lead Free: Lead Free; Min Operating Temperature: -55°C

## Sheet SpannungssensorTP.SchDoc
size A4; SheetNumber: 5; SheetTotal: 7
Used 3 times, as channels U_SpannungssensorTP, U_SpannungssensorTP, U_SpannungssensorTP. Parts and nets are listed once, with the designators drawn on the sheet.
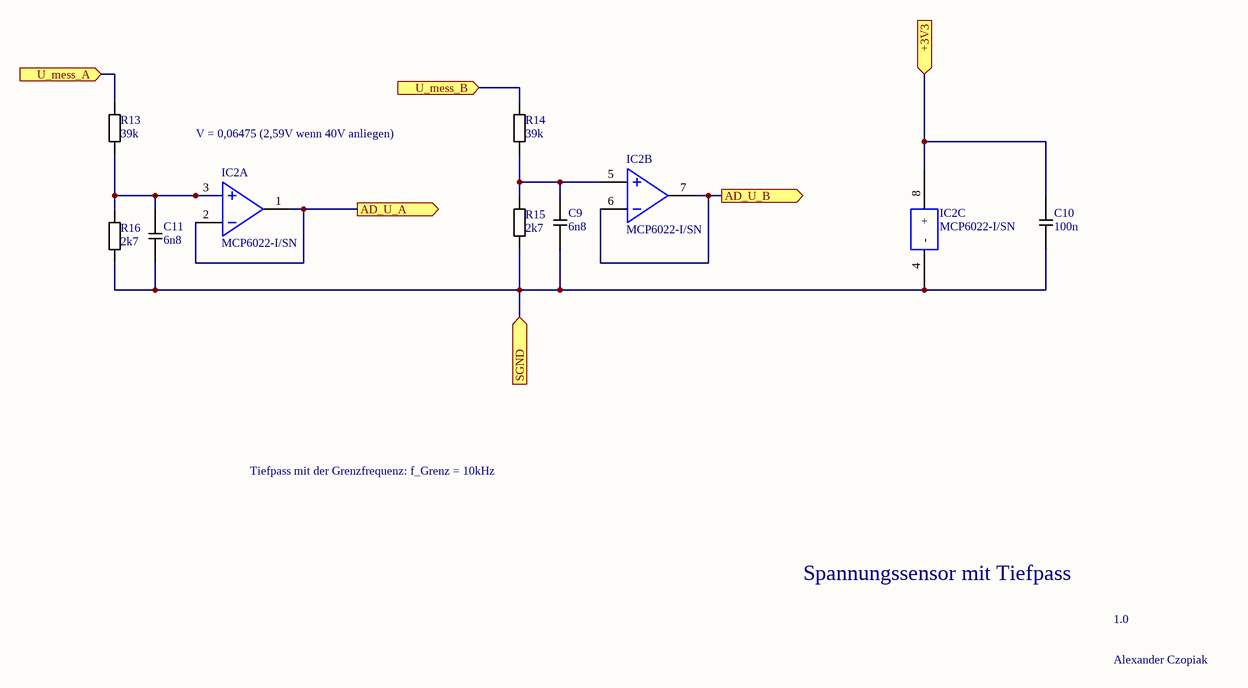
[diagram p5: SpannungssensorTP.SchDoc]

### Parts
C9  6n8  [1206_C]
C10  100n  [1206_C]
C11  6n8  [1206_C]
IC2  MCP6022-I/SN  [SO08_N]  (parts A,B,C of 3)
R13  39k  [1206_R]
R14  39k  [1206_R]
R15  2k7  [1206_R]
R16  2k7  [1206_R]

### Ports
+3V3 (in, see PERSEUS[2C], Gatetreiber[1B], Halbbruecke[2B], Hochsetzsteller[2A], StromsensorTP[3B]), AD_U_A (out, see PERSEUS[2C]), AD_U_B (out, see PERSEUS[2C]), SGND (in, see PERSEUS[2C], Gatetreiber[1D], Halbbruecke[2D], Hochsetzsteller[3D], StromsensorTP[3C]), U_mess_A (in, see PERSEUS[2C]), U_mess_B (in, see PERSEUS[2C])

### Nets
+3V3: C10.2 IC2.8(+) ; port +3V3
AD_U_A: IC2.1 IC2.2 ; port AD_U_A
AD_U_B: IC2.6 IC2.7 ; port AD_U_B
SGND: C9.1 C10.1 C11.1 IC2.4(-) R15.1 R16.1 ; port SGND
U_mess_A: R13.2 ; port U_mess_A
U_mess_B: R14.2 ; port U_mess_B
NetC9_2: C9.2 IC2.5 R14.1 R15.2
NetC11_2: C11.2 IC2.3 R13.1 R16.2

### Channels
U_SpannungssensorTP: designators end in C; ports +3V3=+3V3 AD_U_A=AD_Uin AD_U_B=AD_Uzk SGND=SGND U_mess_A=Uin U_mess_B=Uzk
U_SpannungssensorTP: designators end in B; ports +3V3=+3V3 AD_U_A=AD_U_HBA AD_U_B=NetIC2B_6 SGND=SGND U_mess_A=HB_A_AC U_mess_B=NetR14B_2
U_SpannungssensorTP: designators end in A; ports +3V3=+3V3 AD_U_A=AD_U_HBB AD_U_B=AD_U_HBC SGND=SGND U_mess_A=HB_B_AC U_mess_B=HB_C_AC

### Notes on the sheet
- V = 0,06475 (2,59V wenn 40V anliegen)
- Tiefpass mit der Grenzfrequenz: f_Grenz = 10kHz
- Spannungssensor mit Tiefpass
- 1.0
- Alexander Czopiak

### Library data of the parts
C9-C11 = CAP: Kondensator (ohne Polarität)
R13-R16 = WIDERSTAND

## Sheet Mechanik.SchDoc
size A4; SheetNumber: 7; SheetTotal: 7
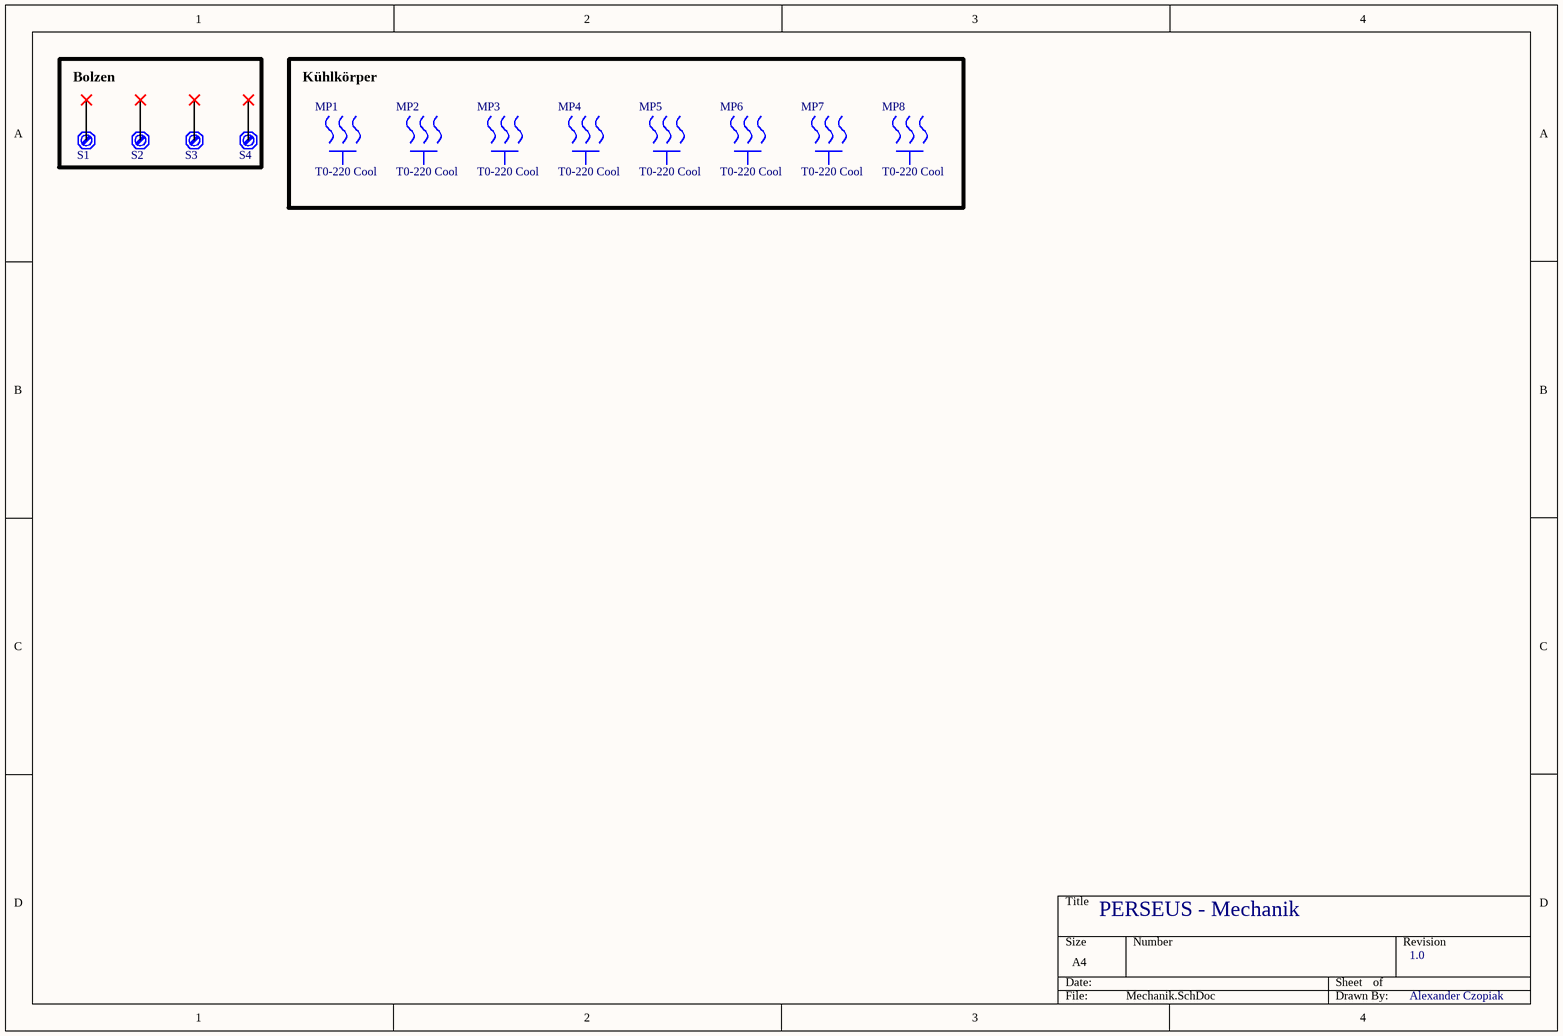
[diagram p6: Mechanik.SchDoc]

### Parts
MP1  T0-220 Cool  [TO-220 Cool]
MP2  T0-220 Cool  [TO-220 Cool]
MP3  T0-220 Cool  [TO-220 Cool]
MP4  T0-220 Cool  [TO-220 Cool]
MP5  T0-220 Cool  [TO-220 Cool]
MP6  T0-220 Cool  [TO-220 Cool]
MP7  T0-220 Cool  [TO-220 Cool]
MP8  T0-220 Cool  [TO-220 Cool]
S1  (no value)  [M3]
S2  (no value)  [M3]
S3  (no value)  [M3]
S4  (no value)  [M3]

### Blocks framed on the sheet
Bolzen: S1-S4
Kühlkörper: MP1-MP8

### Nets

Not connected (* = marked no-connect by the designer): S1 1*; S2 1*; S3 1*; S4 1*

### Notes on the sheet
- PERSEUS - Mechanik
- 1.0
- Alexander Czopiak

### Library data of the parts
MP1-MP8 = Kuehlkoerper TO-220: HEAT SINK TO-220 .500" COMPACT 577202B00000G; Natural Thermal Resistance: 24.4°C/W; Thermal Resistance @ Forced Air Flow (100 LFM): 10°C/W; Finish: Anodized; Shape: Fins; Weight: 0.25lb; Height: 12.7mm; Lead Free: Lead Free; Material: Aluminium; Case/Package: TO-220; Package Cooled: TO-220; REACH SVHC: No SVHC; Type: Passive; Radiation Hardening: No; Height Off Base: 0.5inch; Package Quantity: 2000; Packaging: Bulk; Color: Black; Mount: Bolt; RoHS Compliant: Yes; Width: 0.52inch; Length: 19.05mm; Depth: 13.21mm
S1-S4 = SCHRAUBE/BOLZEN

## Nets that join several sheets
+3V3: PERSEUS (10 pins), U_Halbbruecke/U_StromsensorTP (C6C.2 IC1C.8 P1C.1), U_Halbbruecke/U_Gatetreiber (C16C.2 C17C.2 IC3C.3 IC3C.8), U_Hochsetzsteller/U_StromsensorTP (C6D.2 IC1D.8 P1D.1), U_Hochsetzsteller/U_Gatetreiber (C16D.2 C17D.2 IC3D.3 IC3D.8), U_Halbbruecke/U_StromsensorTP (C6B.2 IC1B.8 P1B.1), U_Halbbruecke/U_Gatetreiber (C16B.2 C17B.2 IC3B.3 IC3B.8), U_Halbbruecke/U_StromsensorTP (C6A.2 IC1A.8 P1A.1), U_Halbbruecke/U_Gatetreiber (C16A.2 C17A.2 IC3A.3 IC3A.8), U_SpannungssensorTP (C10C.2 IC2C.8), U_SpannungssensorTP (C10B.2 IC2B.8), U_SpannungssensorTP (C10A.2 IC2A.8)
GND: PERSEUS (LP1.1 LP6.1 R1.1), U_Halbbruecke (D2C.1 D2C.2 Q2C.3), U_Halbbruecke/U_Gatetreiber (8 pins), Hochsetzsteller (C12.2 C13.2), U_Hochsetzsteller/U_StromsensorTP (IC1D.3 IC1D.4), U_Hochsetzsteller/U_Gatetreiber (8 pins), U_Halbbruecke (D2B.1 D2B.2 Q2B.3), U_Halbbruecke/U_Gatetreiber (8 pins), U_Halbbruecke (D2A.1 D2A.2 Q2A.3), U_Halbbruecke/U_Gatetreiber (8 pins)
SGND: PERSEUS (17 pins), U_Halbbruecke/U_StromsensorTP (5 pins), U_Halbbruecke/U_Gatetreiber (5 pins), U_Hochsetzsteller/U_StromsensorTP (5 pins), U_Hochsetzsteller/U_Gatetreiber (5 pins), U_Halbbruecke/U_StromsensorTP (5 pins), U_Halbbruecke/U_Gatetreiber (5 pins), U_Halbbruecke/U_StromsensorTP (5 pins), U_Halbbruecke/U_Gatetreiber (5 pins), U_SpannungssensorTP (6 pins), U_SpannungssensorTP (6 pins), U_SpannungssensorTP (6 pins)
Uin: PERSEUS (5 pins), U_Halbbruecke/U_Gatetreiber (6 pins), Hochsetzsteller (C13.1 L1.1), U_Hochsetzsteller/U_Gatetreiber (6 pins), U_Halbbruecke/U_Gatetreiber (6 pins), U_Halbbruecke/U_Gatetreiber (6 pins), U_SpannungssensorTP (R13C.2)
AD_U_HBC: PERSEUS (U1.16), U_SpannungssensorTP (IC2A.6 IC2A.7)
AD_Uin: PERSEUS (U1.14), U_SpannungssensorTP (IC2C.1 IC2C.2)
AD_Uzk: PERSEUS (U1.15), U_SpannungssensorTP (IC2C.6 IC2C.7)
GateEnable_A: PERSEUS (R6.2 U1.7), U_Halbbruecke/U_Gatetreiber (IC3C.5)
GateEnable_B: PERSEUS (R7.2 U1.10), U_Halbbruecke/U_Gatetreiber (IC3B.5)
GateEnable_C: PERSEUS (R8.2 U1.13), U_Halbbruecke/U_Gatetreiber (IC3A.5)
GateEnable_HSS: PERSEUS (R5.2 SW1.4), U_Hochsetzsteller/U_Gatetreiber (IC3D.5)
HB_A_AC: PERSEUS (J1.1 U1.24), U_Halbbruecke/U_StromsensorTP (IC1C.3 IC1C.4), U_SpannungssensorTP (R13B.2)
HB_B_AC: PERSEUS (J1.2 U1.23), U_Halbbruecke/U_StromsensorTP (IC1B.3 IC1B.4), U_SpannungssensorTP (R13A.2)
HB_C_AC: PERSEUS (J1.3), U_Halbbruecke/U_StromsensorTP (IC1A.3 IC1A.4), U_SpannungssensorTP (R14A.2)
I_PhaseA: PERSEUS (U1.20), U_Halbbruecke/U_StromsensorTP (C8C.2 R12C.2)
I_PhaseB: PERSEUS (U1.26), U_Halbbruecke/U_StromsensorTP (C8B.2 R12B.2)
I_PhaseC: PERSEUS (U1.21), U_Halbbruecke/U_StromsensorTP (C8A.2 R12A.2)
NetC15A_1: U_Halbbruecke/U_StromsensorTP (IC1A.1 IC1A.2), U_Halbbruecke/U_Gatetreiber (C15A.1 IC3A.14 R19A.2)
NetC15B_1: U_Halbbruecke/U_StromsensorTP (IC1B.1 IC1B.2), U_Halbbruecke/U_Gatetreiber (C15B.1 IC3B.14 R19B.2)
NetC15C_1: U_Halbbruecke/U_StromsensorTP (IC1C.1 IC1C.2), U_Halbbruecke/U_Gatetreiber (C15C.1 IC3C.14 R19C.2)
NetC15D_1: Hochsetzsteller (6 pins), U_Hochsetzsteller/U_Gatetreiber (C15D.1 IC3D.14 R19D.2)
NetD4_1: Hochsetzsteller (D4.1 D4.2 Q4.3), U_Hochsetzsteller/U_StromsensorTP (IC1D.1 IC1D.2)
NetQ1A_1: U_Halbbruecke (Q1A.1), U_Halbbruecke/U_Gatetreiber (R18A.2 R19A.1)
NetQ1B_1: U_Halbbruecke (Q1B.1), U_Halbbruecke/U_Gatetreiber (R18B.2 R19B.1)
NetQ1C_1: U_Halbbruecke (Q1C.1), U_Halbbruecke/U_Gatetreiber (R18C.2 R19C.1)
NetQ2A_1: U_Halbbruecke (Q2A.1), U_Halbbruecke/U_Gatetreiber (R20A.2 R22A.2)
NetQ2B_1: U_Halbbruecke (Q2B.1), U_Halbbruecke/U_Gatetreiber (R20B.2 R22B.2)
NetQ2C_1: U_Halbbruecke (Q2C.1), U_Halbbruecke/U_Gatetreiber (R20C.2 R22C.2)
NetQ3_1: Hochsetzsteller (Q3.1), U_Hochsetzsteller/U_Gatetreiber (R18D.2 R19D.1)
NetQ4_1: Hochsetzsteller (Q4.1), U_Hochsetzsteller/U_Gatetreiber (R20D.2 R22D.2)
PWM_A: PERSEUS (U1.9), U_Halbbruecke/U_Gatetreiber (IC3C.1)
PWM_B: PERSEUS (U1.6), U_Halbbruecke/U_Gatetreiber (IC3B.1)
PWM_C: PERSEUS (U1.12), U_Halbbruecke/U_Gatetreiber (IC3A.1)
PWM_HSS: PERSEUS (U1.8), U_Hochsetzsteller/U_Gatetreiber (IC3D.1)
U_I_HSS: PERSEUS (U1.19), U_Hochsetzsteller/U_StromsensorTP (C8D.2 R12D.2)
Uzk: PERSEUS (LP5.1 R4.2), U_Halbbruecke (D1C.3 Q1C.2), Hochsetzsteller (C12.1 D3.3 Q3.2), U_Halbbruecke (D1B.3 Q1B.2), U_Halbbruecke (D1A.3 Q1A.2), U_SpannungssensorTP (R14C.2)